# Altium project MotherBoard_9bit_SARADC.PrjPcb
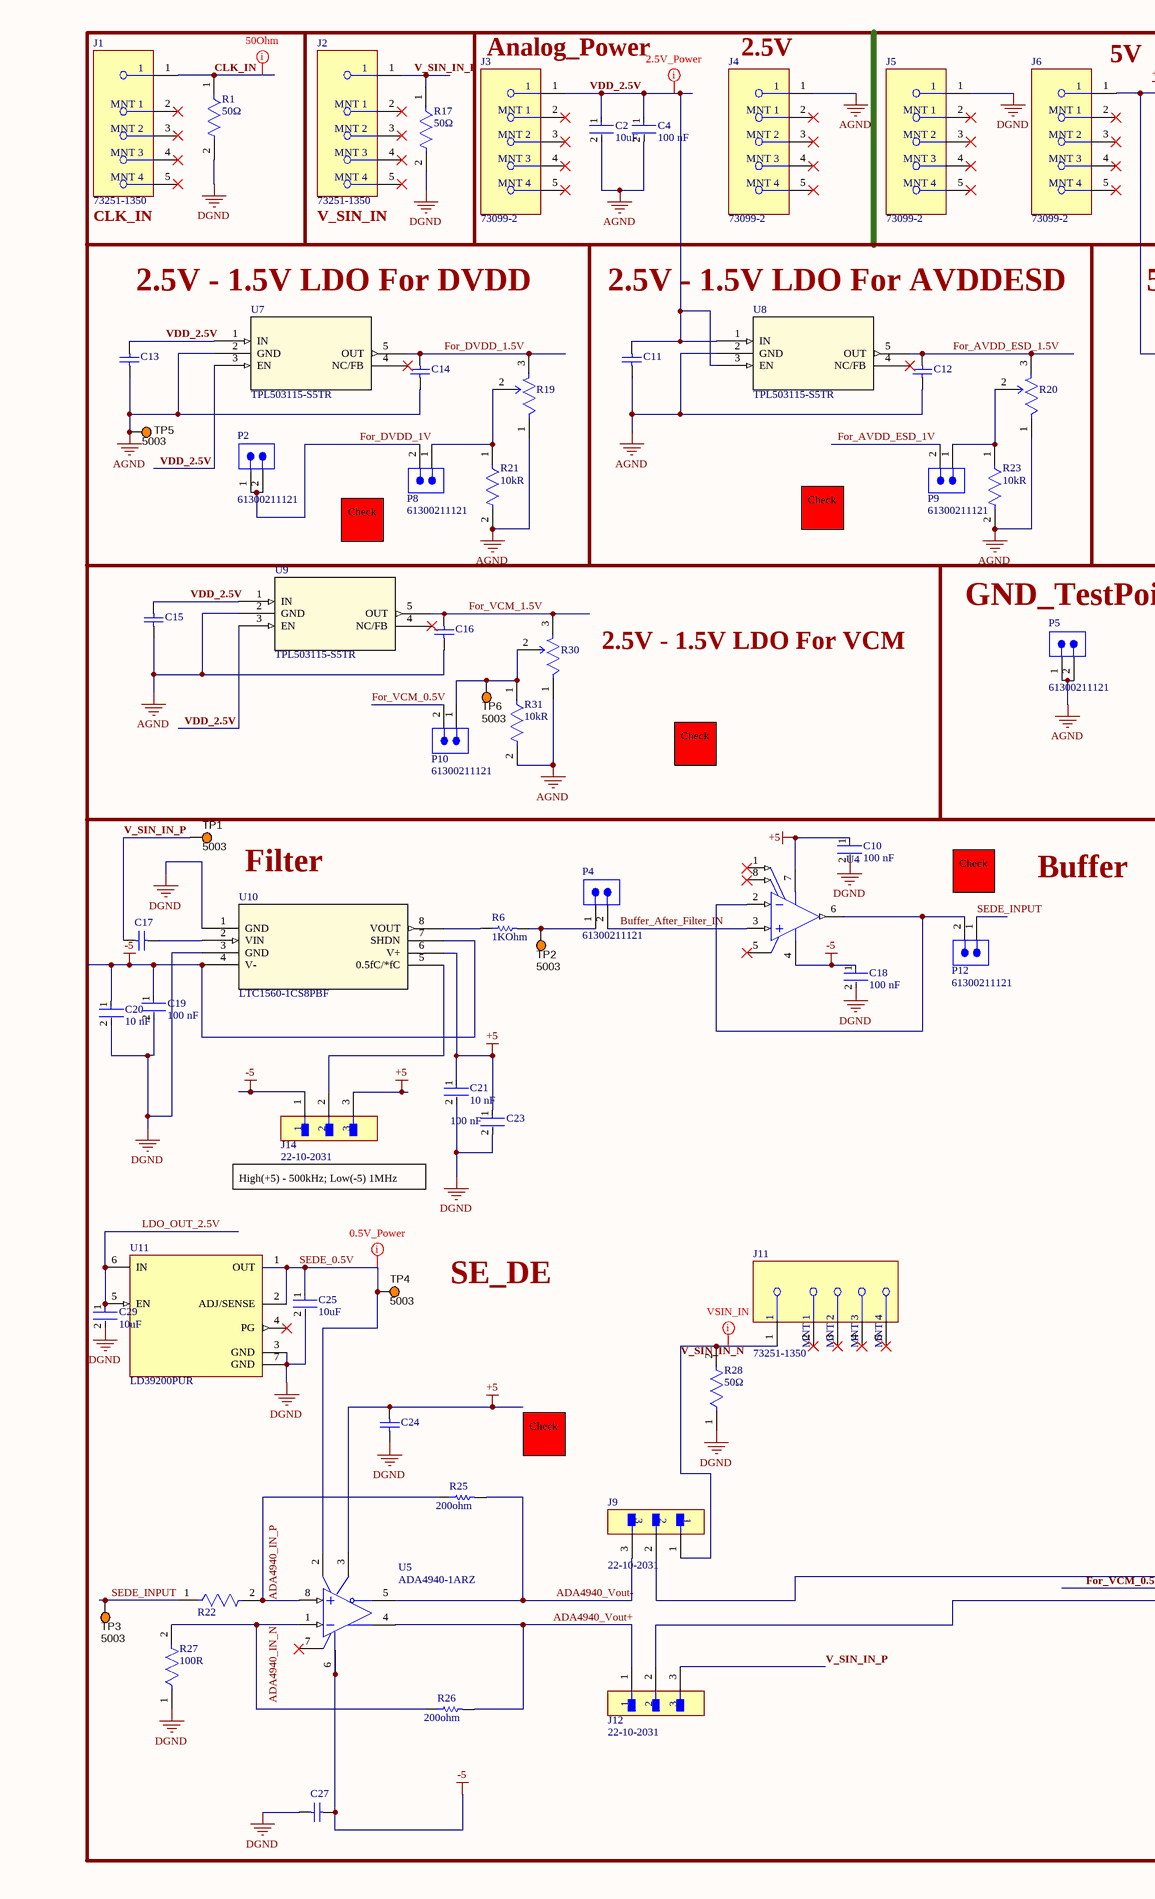
[diagram p0: MotherBoard.SchDoc, left]
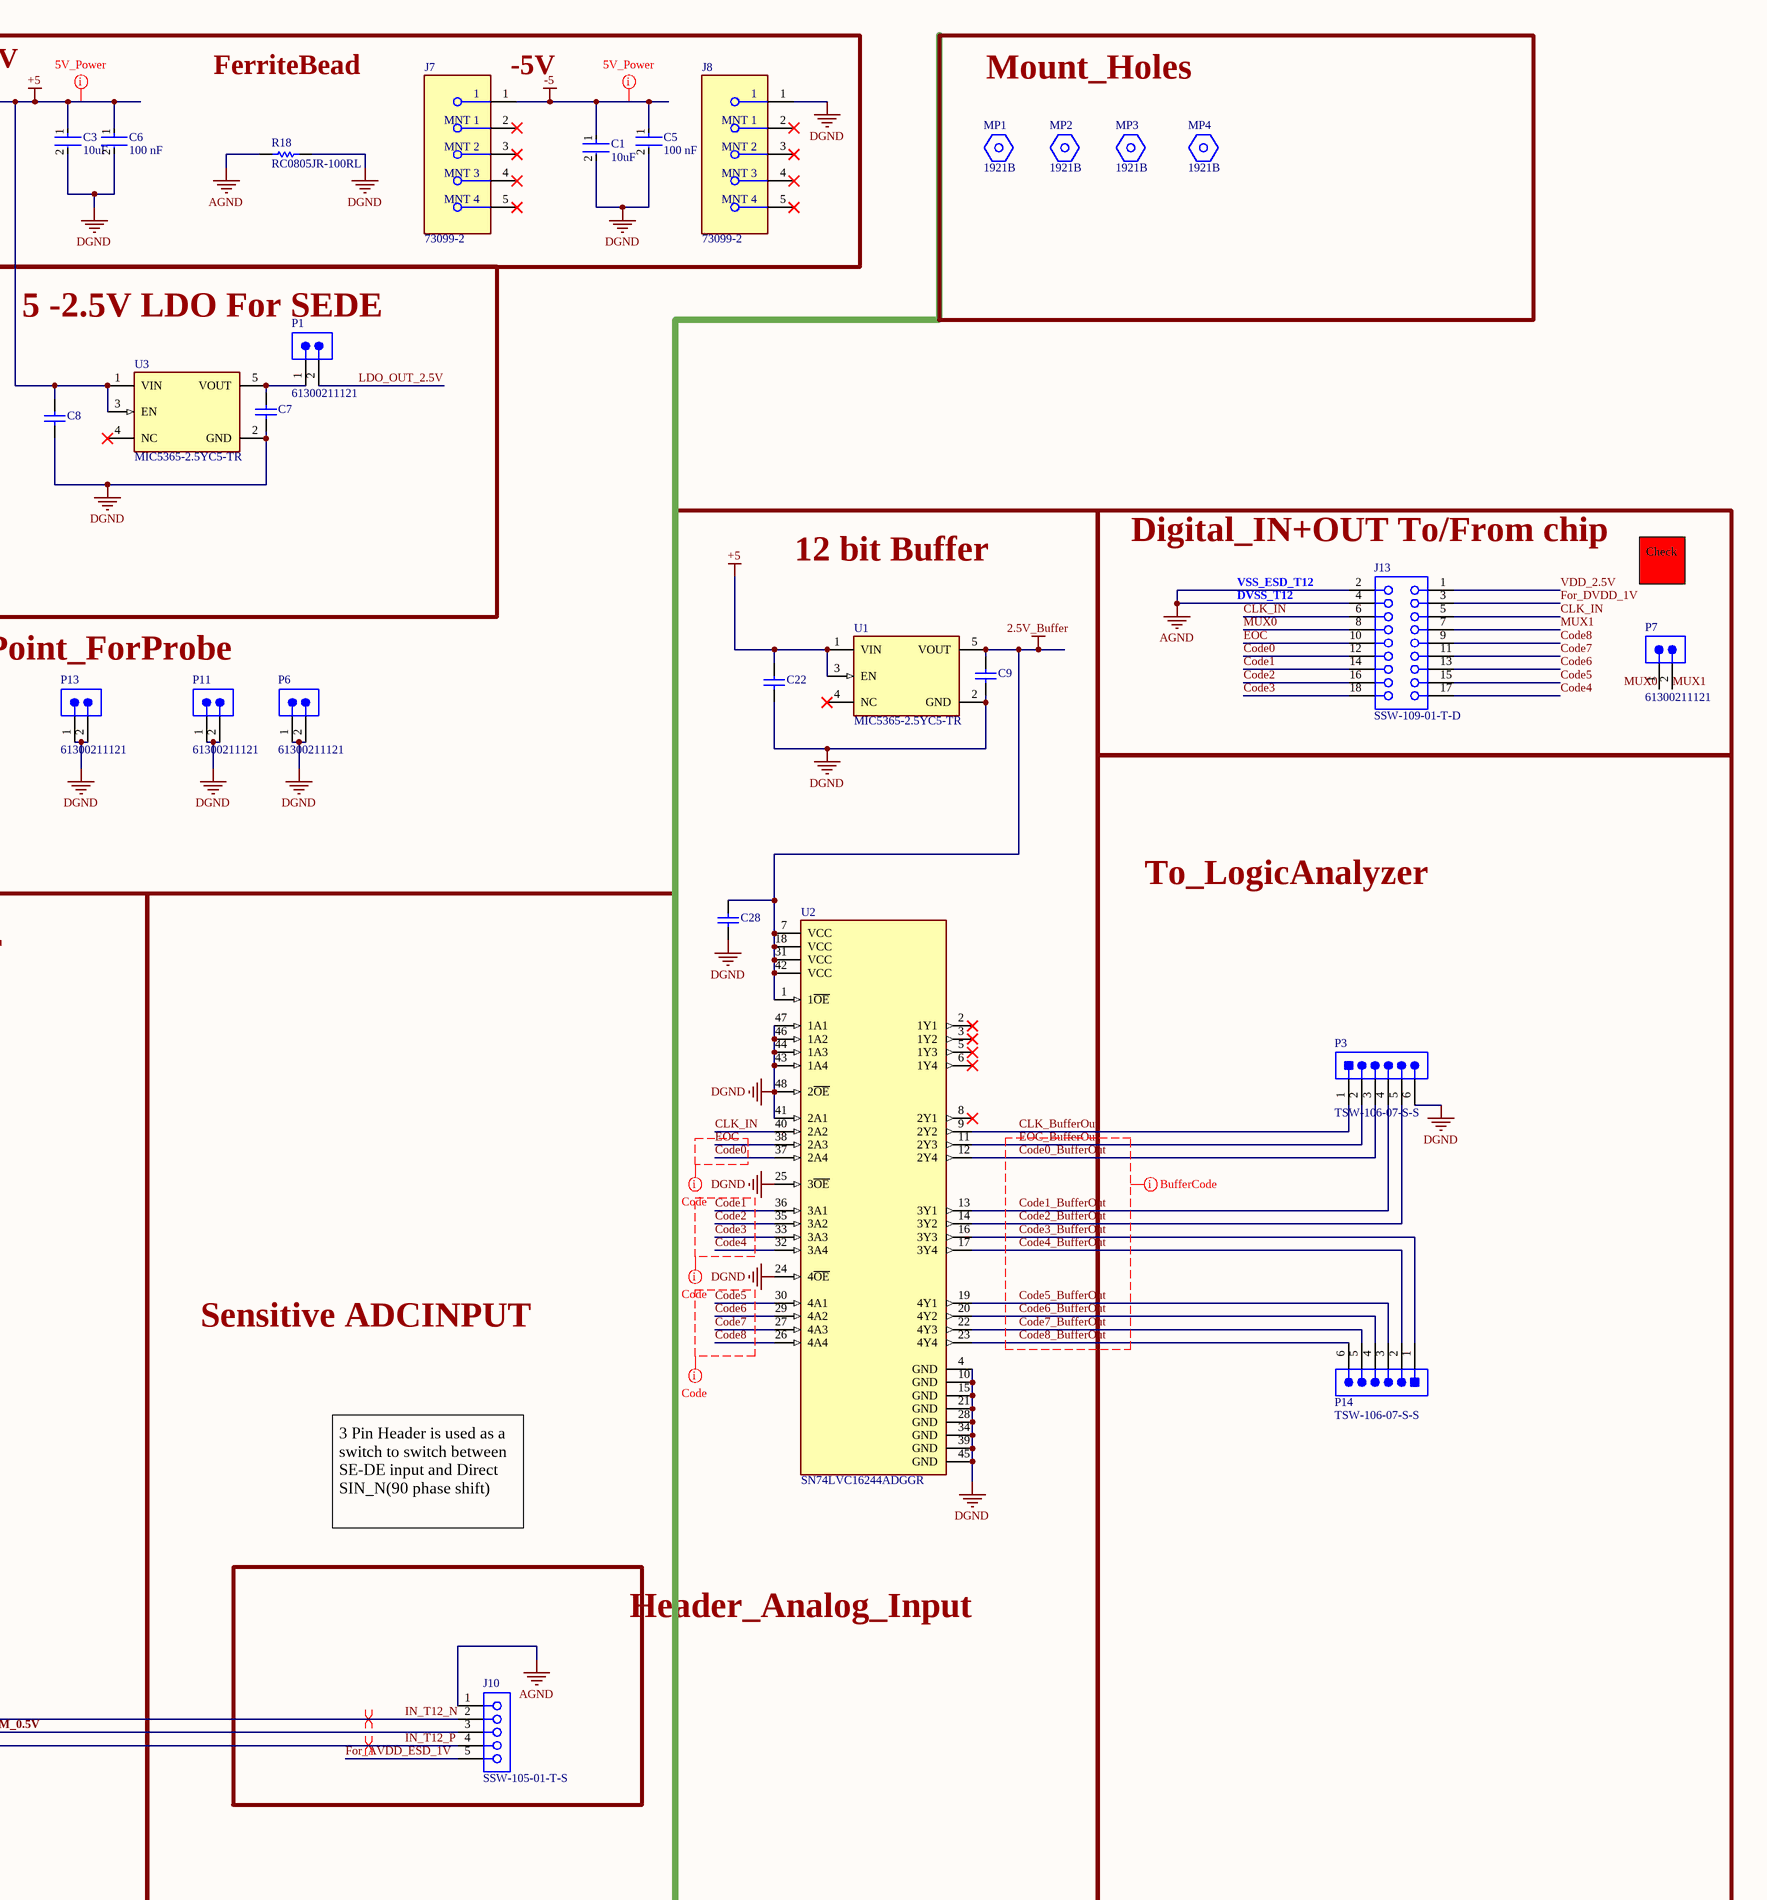
[diagram p1: MotherBoard.SchDoc, right]
1 sheet, 91 parts. Net scope: global (net labels, ports and power ports of the same name join across sheets).
Board file: MotherBoard_Layout.PcbDoc

## Sheet MotherBoard.SchDoc
size A2; SheetNumber: 1; SheetTotal: 1

### Parts
C1  Capacitance: 10uF  [FP-0805-L_2_01_0_2-W_1_25-MFG]  (hidden comment: 0805ZD106MAT2A)
C2  Capacitance: 10uF  [FP-0805-L_2_01_0_2-W_1_25-MFG]  (hidden comment: 0805ZD106MAT2A)
C3  Capacitance: 10uF  [FP-0805-L_2_01_0_2-W_1_25-MFG]  (hidden comment: 0805ZD106MAT2A)
C4  Capacitance: 100 nF  [FP-CC0805-0_85-MFG]  (hidden comment: CC0805KRX7R8BB104)
C5  Capacitance: 100 nF  [FP-CC0805-0_85-MFG]  (hidden comment: CC0805KRX7R8BB104)
C6  Capacitance: 100 nF  [FP-CC0805-0_85-MFG]  (hidden comment: CC0805KRX7R8BB104)
C7  0805ZC105KAZ2A  [CAPC2013X140X50LL20T25]  (value not drawn)
C8  0805ZC105KAZ2A  [CAPC2013X140X50LL20T25]  (value not drawn)
C9  0805ZC105KAZ2A  [CAPC2013X140X50LL20T25]  (value not drawn)
C10  Capacitance: 100 nF  [FP-CC0805-0_85-MFG]  (hidden comment: CC0805KRX7R8BB104)
C11  0805ZC105KAZ2A  [CAPC2013X140X50LL20T25]  (value not drawn)
C12  0805ZC105KAZ2A  [CAPC2013X140X50LL20T25]  (value not drawn)
C13  0805ZC105KAZ2A  [CAPC2013X140X50LL20T25]  (value not drawn)
C14  0805ZC105KAZ2A  [CAPC2013X140X50LL20T25]  (value not drawn)
C15  0805ZC105KAZ2A  [CAPC2013X140X50LL20T25]  (value not drawn)
C16  0805ZC105KAZ2A  [CAPC2013X140X50LL20T25]  (value not drawn)
C17  VJ0805D561KXBAJ  [CAPC2013X145X48ML20T23]  (value not drawn)
C18  Capacitance: 100 nF  [FP-CC0805-0_85-MFG]  (hidden comment: CC0805KRX7R8BB104)
C19  Capacitance: 100 nF  [FP-CC0805-0_85-MFG]  (hidden comment: CC0805KRX7R8BB104)
C20  Capacitance: 10 nF  [FP-CC0805-0_85-MFG]  (hidden comment: CC0805KRX7R9BB103)
C21  Capacitance: 10 nF  [FP-CC0805-0_85-MFG]  (hidden comment: CC0805KRX7R9BB103)
C22  0805ZC105KAZ2A  [CAPC2013X140X50LL20T25]  (value not drawn)
C23  Capacitance: 100 nF  [FP-CC0805-0_85-MFG]  (hidden comment: CC0805KRX7R8BB104)
C24  0805ZC105KAZ2A  [CAPC2013X140X50LL20T25]  (value not drawn)
C25  Capacitance: 10uF  [FP-0805-L_2_01_0_2-W_1_25-MFG]  (hidden comment: 0805ZD106MAT2A)
C27  0805ZC105KAZ2A  [CAPC2013X140X50LL20T25]  (value not drawn)
C28  0805ZC105KAZ2A  [CAPC2013X140X50LL20T25]  (value not drawn)
C29  Capacitance: 10uF  [FP-0805-L_2_01_0_2-W_1_25-MFG]  (hidden comment: 0805ZD106MAT2A)
J1  73251-1350  [FP-73251-1350-MFG]
J2  73251-1350  [FP-73251-1350-MFG]
J3  73099-2  [FP-73099-2-MFG]
J4  73099-2  [FP-73099-2-MFG]
J5  73099-2  [FP-73099-2-MFG]
J6  73099-2  [FP-73099-2-MFG]
J7  73099-2  [FP-73099-2-MFG]
J8  73099-2  [FP-73099-2-MFG]
J9  22-10-2031  [FP-22-10-2031-MFG]
J10  SSW-105-01-T-S  [SMTC-SSW-105-01-X-S]
J11  73251-1350  [FP-73251-1350-MFG]
J12  22-10-2031  [FP-22-10-2031-MFG]
J13  SSW-109-01-T-D  [SMTC-SSW-109-01-X-D]
J14  22-10-2031  [FP-22-10-2031-MFG]
MP1  1921B  [FP-1921B-MFG]
MP2  1921B  [FP-1921B-MFG]
MP3  1921B  [FP-1921B-MFG]
MP4  1921B  [FP-1921B-MFG]
P1  61300211121  [61300211121]
P2  61300211121  [61300211121]
P3  TSW-106-07-S-S  [SMTC-TSW-106-07-S-S_V]
P4  61300211121  [61300211121]
P5  61300211121  [61300211121]
P6  61300211121  [61300211121]
P7  61300211121  [61300211121]
P8  61300211121  [61300211121]
P9  61300211121  [61300211121]
P10  61300211121  [61300211121]
P11  61300211121  [61300211121]
P12  61300211121  [61300211121]
P13  61300211121  [61300211121]
P14  TSW-106-07-S-S  [SMTC-TSW-106-07-S-S_V]
R1  Resistance: 50Ω  [FP-D12-CRCW0805-MFG]  (hidden comment: CRCW080550R0FKTA)
R6  Resistance: 1KOhm  [RESC2013X60X35ML10T20]  (hidden comment: RC0805FR-071KL)
R17  Resistance: 50Ω  [FP-D12-CRCW0805-MFG]  (hidden comment: CRCW080550R0FKTA)
R18  RC0805JR-100RL  [RESC2013X60X35LL10T20]
R19  3296W-1-253LF  [FP-3296W-MFG]  (value not drawn)
R20  3296W-1-253LF  [FP-3296W-MFG]  (value not drawn)
R21  Resistance: 10kR  [FP-CRCW0805-e3-IPC_A]  (hidden comment: CRCW080510K0FKEA)
R22  CRCW0805100RFKEAHP  [FP-CRCW0805-HPe3-IPC_A]  (value not drawn)
R23  Resistance: 10kR  [FP-CRCW0805-e3-IPC_A]  (hidden comment: CRCW080510K0FKEA)
R25  value 200ohm  [RESC2013X70X40ML20T20]  (hidden comment: ERJ-6ENF2000V)
R26  value 200ohm  [RESC2013X70X40ML20T20]  (hidden comment: ERJ-6ENF2000V)
R27  Resistance: 100R  [FP-CRCW0805-HPe3-IPC_A]  (hidden comment: CRCW0805100RFKEAHP)
R28  Resistance: 50Ω  [FP-D12-CRCW0805-MFG]  (hidden comment: CRCW080550R0FKTA)
R30  3296W-1-253LF  [FP-3296W-MFG]  (value not drawn)
R31  Resistance: 10kR  [FP-CRCW0805-e3-IPC_A]  (hidden comment: CRCW080510K0FKEA)
TP1  5003  [KSTN-5003]
TP2  5003  [KSTN-5003]
TP3  5003  [KSTN-5003]
TP4  5003  [KSTN-5003]
TP5  5003  [KSTN-5003]
TP6  5003  [KSTN-5003]
U1  MIC5365-2.5YC5-TR  [FP-SC70-5LD-PL-1-MFG]
U2  SN74LVC16244ADGGR  [FP-DGG0048A-IPC_B]
U3  MIC5365-2.5YC5-TR  [FP-SC70-5LD-PL-1-MFG]
U4  LT1360CS8#PBF  [LT-S8-8_L]  (value not drawn)
U5  ADA4940-1ARZ  [ADI-R-8_L]
U7  TPL503115-S5TR  [SOT23-5-A_TPK]
U8  TPL503115-S5TR  [SOT23-5-A_TPK]
U9  TPL503115-S5TR  [SOT23-5-A_TPK]
U10  LTC1560-1CS8PBF  [SO-8_S_LIT-M]
U11  LD39200PUR  [FP-DFN6-7946637-IPC_A]

### Blocks framed on the sheet
CLK_IN: J1 R1
V_SIN_IN: J2 R17
Mount_Holes: MP1-MP4
2.5V - 1.5V LDO For DVDD: C13 C14 P2 P8 R19 R21 TP5 U7
2.5V - 1.5V LDO For AVDDESD: C11 C12 P9 R20 R23 U8
5 -2.5V LDO For SEDE: C7 C8 P1 U3
12 bit Buffer: C9 C22 C28 U1 U2
Digital_IN+OUT To/From chip: J13 P7
2.5V - 1.5V LDO For VCM: C15 C16 P10 R30 R31 TP6 U9
To_LogicAnalyzer: P3 P14
Header_Analog_Input: J10

### Nets
2.5V_Buffer: C9.2 C28.2 U1.5(VOUT) U2.1(1~{OE}) U2.7(VCC) U2.18(VCC) U2.31(VCC) U2.42(VCC)
+5: C3.1 C6.1 C8.2 C10.1 C21.1 C22.2 C23.1 C24.2 J6.1 J14.3 U1.1(VIN) U1.3(EN) U3.1(VIN) U3.3(EN) U4.7(V+) U5.3(VS+) U10.6(V+)
-5: C1.1 C5.1 C18.1 C19.1 C20.1 C27.2 J7.1 J14.1 U4.4(V-) U5.6(VS-) U10.4(V-) U10.7(SHDN)
AGND: C2.2 C4.2 C11.1 C12.1 C13.1 C14.1 C15.1 C16.1 J4.1 J10.1 J13.2 J13.4 P5.1 P5.2 R18.1 R19.1(CCW) R20.1(CCW) R21.2 R23.2 R30.1(CCW) R31.2 TP5.1 U7.2(GND) U8.2(GND) U9.2(GND)
DGND: C1.2 C3.2 C5.2 C6.2 C7.1 C8.1 C9.1 C10.2 C18.2 C19.2 C20.2 C21.2 C22.1 C23.2 C24.1 C25.2 C27.1 C28.1 C29.2 J5.1 J8.1 P3.6 P6.1 P6.2 P11.1 P11.2 P13.1 P13.2 R1.2 R17.2 R18.2 R27.1 R28.1 U1.2(GND) U2.4(GND) U2.10(GND) U2.15(GND) U2.21(GND) U2.24(4~{OE}) U2.25(3~{OE}) U2.28(GND) U2.34(GND) U2.39(GND) U2.41(2A1) U2.43(1A4) U2.44(1A3) U2.45(GND) U2.46(1A2) U2.47(1A1) U2.48(2~{OE}) U3.2(GND) U10.1(GND) U10.3(GND) U11.3(GND) U11.7(GND)
ADA4940_IN_N: R26.1 R27.2 U5.1(IN-)
ADA4940_IN_P: R22.2 R25.1 U5.8(IN+)
ADA4940_Vout+: J12.1 R26.2 U5.4(OUT+)
ADA4940_Vout-: J9.3 R25.2 U5.5(OUT-)
Buffer_After_Filter_IN: P4.2 U4.3(+IN)
CLK_BufferOut: P3.1 U2.9(2Y2)
CLK_IN: J1.1 J13.5 J13.6 R1.1 U2.40(2A2)
Code0: J13.12 U2.37(2A4)
Code0_BufferOut: P3.3 U2.12(2Y4)
Code1: J13.14 U2.36(3A1)
Code1_BufferOut: P3.4 U2.13(3Y1)
Code2: J13.16 U2.35(3A2)
Code2_BufferOut: P3.5 U2.14(3Y2)
Code3: J13.18 U2.33(3A3)
Code3_BufferOut: P14.1 U2.16(3Y3)
Code4: J13.17 U2.32(3A4)
Code4_BufferOut: P14.2 U2.17(3Y4)
Code5: J13.15 U2.30(4A1)
Code5_BufferOut: P14.3 U2.19(4Y1)
Code6: J13.13 U2.29(4A2)
Code6_BufferOut: P14.4 U2.20(4Y2)
Code7: J13.11 U2.27(4A3)
Code7_BufferOut: P14.5 U2.22(4Y3)
Code8: J13.9 U2.26(4A4)
Code8_BufferOut: P14.6 U2.23(4Y4)
EOC: J13.10 U2.38(2A3)
EOC_BufferOut: P3.2 U2.11(2Y3)
For_AVDD_ESD_1.5V: C12.2 R20.3(CW) U8.5(OUT)
For_AVDD_ESD_1V: J10.5 P9.2
For_DVDD_1.5V: C14.2 R19.3(CW) U7.5(OUT)
For_DVDD_1V: J13.3 P2.1 P2.2 P8.2
For_VCM_0.5V: J10.3 P10.2
For_VCM_1.5V: C16.2 R30.3(CW) U9.5(OUT)
IN_T12_N: J9.2 J10.2
IN_T12_P: J10.4 J12.2
LDO_OUT_2.5V: C29.1 P1.2 U11.5(EN) U11.6(IN)
MUX0: J13.8 P7.1
MUX1: J13.7 P7.2
SEDE_0.5V: C25.1 TP4.1 U5.2(VOCM) U11.1(OUT) U11.2(ADJ/SENSE)
SEDE_INPUT: P12.1 R22.1 TP3.1
V_SIN_IN_N: J9.1 J11.1 R28.2
V_SIN_IN_P: C17.1 J2.1 J12.3 R17.1 TP1.1
VDD_2.5V: C2.1 C4.1 C11.2 C13.2 C15.2 J3.1 J13.1 U7.1(IN) U7.3(EN) U8.1(IN) U8.3(EN) U9.1(IN) U9.3(EN)
NetC7_2: C7.2 P1.1 U3.5(VOUT)
NetC17_2: C17.2 U10.2(VIN)
NetJ14_2: J14.2 U10.5(0.5fC/*fC)
NetP4_1: P4.1 R6.2 TP2.1
NetP8_1: P8.1 R19.2(WIPER) R21.1
NetP9_1: P9.1 R20.2(WIPER) R23.1
NetP10_1: P10.1 R30.2(WIPER) R31.1 TP6.1
NetP12_2: P12.2 U4.2(-IN) U4.6(VOUT)
NetR6_1: R6.1 U10.8(VOUT)

Not connected (* = marked no-connect by the designer): J1 2(MNT_1)* 3(MNT_2)* 4(MNT_3)* 5(MNT_4)*; J2 2(MNT_1)* 3(MNT_2)* 4(MNT_3)* 5(MNT_4)*; J3 2(MNT_1)* 3(MNT_2)* 4(MNT_3)* 5(MNT_4)*; J4 2(MNT_1)* 3(MNT_2)* 4(MNT_3)* 5(MNT_4)*; J5 2(MNT_1)* 3(MNT_2)* 4(MNT_3)* 5(MNT_4)*; J6 2(MNT_1)* 3(MNT_2)* 4(MNT_3)* 5(MNT_4)*; J7 2(MNT_1)* 3(MNT_2)* 4(MNT_3)* 5(MNT_4)*; J8 2(MNT_1)* 3(MNT_2)* 4(MNT_3)* 5(MNT_4)*; J11 2(MNT_1)* 3(MNT_2)* 4(MNT_3)* 5(MNT_4)*; U1 4(NC)*; U2 2(1Y1)* 3(1Y2)* 5(1Y3)* 6(1Y4)* 8(2Y1)*; U3 4(NC)*; U4 1(NULL)* 5(NC)* 8(NULL)*; U5 7(~{DISABLE})*; U7 4(NC/FB)*; U8 4(NC/FB)*; U9 4(NC/FB)*; U11 4(PG)*

### Layout directives
differential pair: IN_T12_N, IN_T12_P
rule Width Constraint [Pref Width = 40mil    Min Width = 20mil    Max Width = 100mil]: -5
rule Width Constraint [Pref Width = 20mil    Min Width = 20mil    Max Width = 100mil]: +5, SEDE_0.5V, VDD_2.5V
net class CLK: CLK_IN
net class INPUT_Signal: V_SIN_IN_N
net class Buffer_OUT: Code0_BufferOut, Code1_BufferOut, Code2_BufferOut, Code3_BufferOut, Code4_BufferOut, Code5_BufferOut, Code6_BufferOut, Code7_BufferOut, Code8_BufferOut, EOC_BufferOut
net class Code: Code0, Code1, Code2, Code3, Code4, Code5, Code6, Code7, Code8, EOC

### Notes on the sheet
- (near J3) Analog_Power
- (near J4) 2.5V
- (near J6) 5V
- FerriteBead
- (near J7) -5V
- Check
- DVSS_T12
- VSS_ESD_T12
- GND_TestPoint_ForProbe
- Filter
- Buffer
- High(+5) - 500kHz; Low(-5) 1MHz
- Sensitive ADCINPUT
- SE_DE
- 3 Pin Header is used as a switch to switch between SE-DE input and Direct SIN_N(90 phase shift)

### Library data of the parts
C1-C3 C25 C29 = CMP-2007-04682-2: General Purpose Ceramic Capacitor, 0805, 10uF, 20%, X5R, 15%, 10V; Dissipation Factor: 12.5%; Insulation Resistance: 10GR; Contact Plating: Tin; Packaging: Tape and Reel; Length: 2.01mm; Dielectric: X5R; RoHS Compliant: Yes; Series: -; Case Code (Metric): 2012; Tolerance: 20%; Min Operating Temperature: -55°C; REACH SVHC: No SVHC; Termination: SMD/SMT; Width: 0.049inch; Mount: Surface Mount; Construction: Flat; Lead Free: Lead Free; Depth: 1.25mm; Height: 1.3mm; Voltage: 10V; Case Code (Imperial): 0805; Package Quantity: 3000; Number of Pins: 2; Voltage Rating (DC): 10V; Radiation Hardening: No; Case/Package: 0805; Max Operating Temperature: 85°C; Voltage Rating: 10V; Thickness: 0.055inch; Dielectric Material: Ceramic
C4-C6 C10 C18 C19 C23 = CMP-1036-04410-2: CAP CER 0.1UF 25V X7R 0805; Manufacturer: Yageo; Tolerance: 0.1; Material: Ceramic; Value: 100 nF; ComponentLink2URL: http://www.yageo.com/documents/recent/UPY-GPHC_Y5V_6.3V-to-50V_8.pdf; Category: Cap; Mouser Description: Multilayer Ceramic Capacitors MLCC - SMD/SMT 100nF 25V X7R 10%; Manufacturer Part Number: CC0805KRX7R8BB104; Device Class L1: Passive Components; Footprint Url: http://www.yageo.com/exep/pages/download/literatures/UPY-C_GEN_24.pdf; Height: 0.95mm; Digikey Description: CAP CER 0.1UF 25V X7R 0805; Lead Free: Yes; Temperature Range High: +85°C; Temperature: -30°C to +85°C; Ipc Land Pattern Name: CAPC200125X85; Automotive: No; Octopart: https://octopart.com/cc0805krx7r8bb104-yageo-39467766; Device Class L2: Capacitors; Temperature Characteristic: X7R; Voltage Rating: 25 V; ComponentLink2Description: Datasheet; Temperature Range Low: -30°C; Device Class L3: Ceramic Capacitors; RoHS: TRUE; Package: CC0805-0.85
C7-C9 C11-C16 C22 C24 C27 C28 = CMP-2007-04674-1: Manufacturer: AVX Interconnect / Elco; Part Number: 0805ZC105KAZ2A
C17 = CMP-2007-03149-1: Manufacturer: Vitramon; Part Number: VJ0805D561KXBAJ
C20 C21 = CMP-1036-03842-3: CAP CER 10000PF 50V X7R 0805; Manufacturer: Yageo; Material: Ceramic; Value: 10 nF; Tolerance: 0.1; Footprint Url: http://www.yageo.com/exep/pages/download/literatures/UPY-C_GEN_24.pdf; Temperature Characteristic: X7R; ComponentLink2Description: Datasheet; Lead Free: Yes; Height: 0.95mm; Temperature Range High: +85°C; Automotive: No; Octopart: https://octopart.com/cc0805krx7r9bb103-yageo-192989; Device Class L1: Passive Components; Mouser Description: Multilayer Ceramic Capacitors MLCC - SMD/SMT 10nF 50V X7R 10%; Temperature: -30°C to +85°C; Device Class L2: Capacitors; Ipc Land Pattern Name: CAPC200125X85; Device Class L3: Ceramic Capacitors; Temperature Range Low: -30°C; RoHS: TRUE; Manufacturer Part Number: CC0805KRX7R9BB103; Voltage Rating: 50 V; Package: CC0805-0.85; Category: Cap; ComponentLink2URL: http://www.yageo.com/documents/recent/UPY-GPHC_Y5V_6.3V-to-50V_8.pdf; Digikey Description: CAP CER 10000PF 50V X7R 0805
J1 J2 J11 = CMP-04764-000006-1: CONN SMA JACK STR 50 OHM SMD; Manufacturer: Molex; Is Female: yes; Standoff Height: 0.41mm; Impedance: 50Ω; Number Of Contacts: 1; Conn Orientation: Straight; Voltage Rating: 500V; Shielding: true; Frequency: 18GHz; Package: 73251-1350; Device Class L1: Connectors; Category: Conn; Manufacturer Part Number: 73251-1350; ComponentLink2URL: https://www.molex.com/pdm_docs/sd/732511350_sd.pdf; Automotive: No; Height: 9.655mm; Octopart: https://octopart.com/73251-1350-molex-5414390; Footprint Url: https://forum.upverter.com/uploads/default/original/3X/d/a/daeafa2ce4908d4fc4e49f0b17d7d2c986fce444.pdf; Temperature Range High: +165°C; Device Class L3: unset; Mouser Description: RF Connectors / Coaxial Connectors SMA ST PCB-JCK STD SMT; Lead Free: Yes; Temperature: -65°C to +165°C; RoHS: TRUE; ComponentLink2Description: Datasheet; Device Class L2: RF / Coaxial Connectors; Digikey Description: CONN SMA JACK STR 50 OHM SMD; Contact Material: Gold; Temperature Range Low: -65°C
J3-J8 = CMP-73906-000005-1: R/A 4MM MOUNTG SAFE JACK/PCB RED
J9 J12 J14 = CMP-04776-000653-1: CONN HEADER VERT 3POS 2.54MM; Insulation Resistance: 50GR; Glow Wire Compliant: Non-compliant; Number of Contacts: 3; Max Current Rating: 4A; Voltage Rating (DC): 250V; Gender: Male; Contact Resistance: 10mR; Approvals: UL; Color: White; Radiation Hardening: No; Pitch: 2.54mm; Packaging: Bulk; Orientation: Straight; Housing Material: Nylon; Depth: 2.34mm; Flammability Rating: UL94 V-0; Number of Circuits: 3; Min Operating Temperature: 0°C; Lead Free: Lead Free; Contact Plating: Gold; Halogen Free: Low Halogen; Max Voltage Rating (AC): 250V; Length: 7.37mm; Height: 10.79mm; Current Rating: 4A; Series: KK® 4030; Contact Material: Brass; Number of Rows: 1; Housing Color: White; Voltage Rating: 250V; Package Quantity: 2000; Number of Positions: 3; Contact Type: Male Pin; Mount: Through Hole; Max Operating Temperature: 75°C; Termination: Solder; Contact Mating Length: 0.295inch
J10 = CMP-1023-00345-1: SQ Post Socket, Through-hole, Vertical, -55 to 105 degC, 2.54mm Pitch, 5-Pin, Female, RoHS; Manufacturer: Samtec; Pitch: 2.54 mm; Orientation: Vertical; ComponentLink1Description: Manufacturer URL; ComponentLink1URL: http://www.samtec.com; RoHS: True; PackageDescription: Assembly, Socket Strip .016 X .031 Tail; PackageReference: SSW-105-01-X-S; ComponentLink3URL: http://www.samtec.com/documents/webfiles/cpdf/SSW-1XX-XX-XXX-X-XX-XXX-XX-MKT.pdf; PartNumber: SSW-105-01-T-S; Temperature Range: -55 to 105 degC; Mounting Technology: Through-hole; PackageVersion: CA, 6/1987; ComponentLink2URL: http://www.samtec.com/documents/webfiles/pdf/SSW_TH.PDF; DatasheetVersion: F-214; ComponentLink2Description: Datasheet; ComponentLink3Description: Package Specification
J13 = CMP-1023-00387-1: SQ Post Socket, Through-hole, Vertical, -55 to 105 degC, 2.54mm Pitch, 18-Pin, Female, RoHS; Manufacturer: Samtec; Mounting Technology: Through-hole; Orientation: Vertical; Pitch: 2.54 mm; DatasheetVersion: F-214; ComponentLink3Description: Package Specification; ComponentLink1Description: Manufacturer URL; PartNumber: SSW-109-01-T-D; RoHS: True; PackageVersion: CA, 6/1987; ComponentLink2URL: http://www.samtec.com/documents/webfiles/pdf/SSW_TH.PDF; ComponentLink2Description: Datasheet; ComponentLink3URL: http://www.samtec.com/documents/webfiles/cpdf/SSW-1XX-XX-XXX-X-XX-XXX-XX-MKT.pdf; PackageDescription: Assembly, Socket Strip .016 X .031 Tail; Temperature Range: -55 to 105 degC; PackageReference: SSW-109-01-X-D; ComponentLink1URL: http://www.samtec.com
MP1-MP4 = CMP-00214-00374361-1: 1921B Standoff, 1/4 Hex, Female, Threaded 4-40, Length .500, Stainless Steel; NexarPartId: 374361; Outside Diameter: 6.35mm; Gender: Female, Female; Length: 12.7mm; Threaded/Unthreaded: Threaded; Width: 6.35mm; Color: Natural; Shape: Hex; RoHS: Compliant; Lead Free: Lead Free; Material: Stainless Steel; Height: 12.827mm; Diameter: 6.35mm
P1 P2 P4-P13 = CMP-1712-00002-6: NexarPartId: 20081794; Number of Contacts: 2; Pitch: 2.54mm; Connector Type: Male Pin; Voltage Rating: 250V; Current Rating: 3A; Gender: Male; Contact Resistance: 20mΩ; Height: 8.94mm; Lead Free: Lead Free; Number of Pins: 2; Termination: Through Hole; RoHS: Compliant; Lead Pitch: 2.54mm; REACH SVHC: No SVHC; Housing Material: PBT; Contact Mating Length: 5.9944mm; Min Operating Temperature: -40°C; Orientation: Vertical; Contact Material: Copper; Contact Gender: Male; Max Operating Temperature: 125°C; Number of Rows: 1; Number of Positions: 2; Packaging: Bulk; Contact Plating: Gold; Mount: Through Hole; Color: Black; Operating Supply Voltage: 250V
P3 P14 = CMP-1681-00007-2: Male Header, Pitch 2.54 mm, 1 x 6 Position, Height 8.38 mm, Tail Length 2.54 mm, -55 to 125 degC, RoHS, Bulk; Manufacturer: Samtec; Rows: 1; Contact Finish: Gold; Lead Pitch: 0.1 inch; Package Quantity: 1; Mounting Technology: Through Hole; ComponentLink1Description: Manufacturer URL; Contact Plating: Gold; DatasheetVersion: 12/2015; ComponentLink3Description: Package Specification; PackageDescription: Male Header, Pitch 2.54 mm, 1 x 6 Position, Height 8.38 mm, Tail Length 2.54 mm; Height: 8.38 mm; ComponentLink2Description: Datasheet; RoHSCompliant: true; Colour: Black; Packaging: Bulk; Min Operating Temperature: -55 degC; ComponentLink2URL: http://suddendocs.samtec.com/catalog_english/tsw_th.pdf; Mount: Through Hole; PackageReference: TSW-102-07-S-S; Pins: 6; Max Operating Temperature: 125 degC; ComponentLink3URL: http://suddendocs.samtec.com/prints/tsw-xxx-xx-x-x-xx-xxx-footprint.pdf; Length: 15.24 mm; Contact Material: Bronze; ComponentLink1URL: http://www.samtec.com/
R1 R17 R28 = CMP-00030-21390498-1: CRCW080550R0FKTA Res Thick Film 0805 50 Ohm 1% 0.125W(1/8W) ±100ppm/C Pad SMD Automotive T/R; Temperature Coefficient: 100ppm/°C; Voltage Rating: 150V; Power Rating: 125mW; Length: 2mm; Case Code (Imperial): 0805; Height: 450µm; Contact Plating: Lead, Tin; Width: 1.25mm; Max Operating Temperature: 155°C; NexarPartId: 21390498; Case Code (Metric): 2012; Min Operating Temperature: -55°C; Tolerance: 1%; Case/Package: 0805; Lead Free: Contains Lead; RoHS: Non-Compliant; Composition: Thick Film; Weight: 5.499807mg
R6 = CMP-2100-03671-1: Chip Resistor, 1 KOhm, +/- 1%, 125 mW, -55 to 155 degC, 0805 (2012 Metric), RoHS, Tape and Reel; Manufacturer: Yageo; Temperature Coefficient: 100ppm/degreesC; Voltage Rating (DC): 150V; Max Power Dissipation: 125mW; Number of Pins: 2; Number of Terminations: 2; Datasheet URL: http://www.yageo.com/NewPortal/yageodocoutput?fileName=/pdf/R-Chip/PYu-RC_Group_51_RoHS_L_5.pdf; Length: 0.079inch; Package Description: 2-Pin Surface Mounted Device, Body 2 x 1.25 mm; Depth: 1.25mm; Height: 0.024inch; Military Standard: Not; Case/Package: 0805; Package Reference: 0805; RoHSCompliant: true; Lead Free: LeadFree; Packaging: TapeandReel; Package Quantity: 1; Datasheet Version: Rev. 5, 10/2016; Tolerance: 1%; Min Operating Temperature: -55degC; Voltage Rating: 150V; Composition: ThickFilm; Case Code (Imperial): 0805; Power Rating: 125mW; Width: 0.049inch; Case Code (Metric): 2012; Manufacturer URL: http://www.yageo.com/; Max Operating Temperature: 155degC; REACH SVHC: Unknown; Termination: SMD/SMT
R18 = CMP-2000-06963-1: Chip Resistor, 0 Ohm, +/- 5%, 125 mW, -55 to 155 degC, 0805 (2012 Metric), RoHS, Tape and Reel; Manufacturer: Yageo; Product Length (mm): 2mm; Tolerance (+ or -): NotRequired; Case Style: Molded; Product Height (mm): 0.5mm; Power Rating(s): NotRequiredW; Product Depth (mm): 1.25mm; Mounting Technology: SurfaceMount; Military Standard: NotRequired; Operating Temp Range: -55Cto155C; Temperature Coefficient: NotRequired; Package Description: 2-Pin Surface Mounted Device, Body 2 x 1.25 mm; Datasheet Version: Rev. 7, 05/2017; Failure Rate: NotRequired; Manufacturer URL: http://www.yageo.com/; Datasheet URL: http://www.yageo.com/documents/recent/PYu-RC_Group_51_RoHS_L_7.pdf; Packaging: TapeandReel; Package Reference: 0805; Package / Case: 0805; Termination Style: NotRequired; Type: ThickFilm; Construction: Rectangular
R19 R20 R30 = CMP-07234-000034-1: TRIMMER 25K OHM 0.5W PC PIN TOP; Temperature Coefficient: 100ppm/°C; Resistance Tolerance: 10%; Resistance: 25kR; Power Rating: 500mW; Number of Turns: 25; Voltage Rating (DC): 300V; Taper: Linear; Resistor Type: Cermet; REACH SVHC: No SVHC; Height: 0.395inch; Military Standard: Not; Color: Blue; Tolerance: 10%; Depth: 4.83mm; Package Quantity: 50; Termination: Pin; Radiation Hardening: No; Packaging: Rail/Tube; Lead Free: Lead Free; Length: 9.53mm; Series: 3296; Weight: 0.03oz; RoHS Compliant: Yes; Mount: Panel; Max Power Dissipation: 500mW; Width: 9.53mm; Technology: CERMET; Min Operating Temperature: -55°C; Max Operating Temperature: 125°C
R21 R23 R31 = CMP-2001-04908-2: RES Thick Film, 10kΩ, 1%, 0.125W, 100ppm/°C, 0805; Voltage Rating (DC): 150V; Power Rating: 125mW; Weight: 0.000194oz; Package Quantity: 5000; Military Standard: Not; Max Operating Temperature: 155°C; Temperature Coefficient: 100ppm/°C; Contact Plating: Tin; Width: 1.25mm; Height: 0.45mm; Radiation Hardening: No; Tolerance: 1%; Min Operating Temperature: -55°C; Voltage Rating: 150V; Length: 2mm; Depth: 1.25mm; Termination: SMD/SMT; Packaging: Tape and Reel; Case/Package: 0805; Case Code (Metric): 2012; Lead Free: Lead Free; Case Code (Imperial): 0805; Composition: Thick Film
R22 = CMP-02407-011702-1: RES Thick Film, 100Ω, 1%, 0.5W, 100ppm/°C, 0805; Power Rating: 330mW; Voltage Rating: 150V; Max Power Dissipation: 500mW; Resistance: 100R; Case/Package: 0805; Radiation Hardening: No; Number of Terminations: 2; Features: Automotive AEC-Q200; RoHS Compliant: Yes; Height: 0.5mm; Technology: THICK FILM; Contact Plating: Tin; Series: CRCW-HP; Max Operating Temperature: 155°C; Tolerance: 1%; Package Quantity: 5000; Construction: Rectangular; Width: 1.2mm; Lead Free: Lead Free; Resistor Type: Thick Film; Resistance Tolerance: 1%; Length: 2mm; Weight: 0.000194oz; Termination: SMD/SMT; Depth: 1.25mm; Packaging: Tape and Reel; Voltage Rating (DC): 150V; Case Code (Imperial): 0805; Military Standard: Not; Case Code (Metric): 2012; Mount: Surface Mount; Min Operating Temperature: -55°C; Temperature Coefficient: 100ppm/°C
R25 R26 = CMP-2001-00025-1: Manufacturer: Panasonic; Part Number: ERJ-6ENF2000V
R27 = CMP-02407-011702-1: RES Thick Film, 100Ω, 1%, 0.5W, 100ppm/°C, 0805; Power Rating: 330mW; Voltage Rating: 150V; Max Power Dissipation: 500mW; Case/Package: 0805; Radiation Hardening: No; Number of Terminations: 2; Features: Automotive AEC-Q200; RoHS Compliant: Yes; Height: 0.5mm; Technology: THICK FILM; Contact Plating: Tin; Series: CRCW-HP; Max Operating Temperature: 155°C; Tolerance: 1%; Package Quantity: 5000; Construction: Rectangular; Width: 1.2mm; Lead Free: Lead Free; Resistor Type: Thick Film; Resistance Tolerance: 1%; Length: 2mm; Weight: 0.000194oz; Termination: SMD/SMT; Depth: 1.25mm; Packaging: Tape and Reel; Voltage Rating (DC): 150V; Case Code (Imperial): 0805; Military Standard: Not; Case Code (Metric): 2012; Mount: Surface Mount; Min Operating Temperature: -55°C; Temperature Coefficient: 100ppm/°C
TP1-TP6 = CMP-1672-00009-1: Test Point, Orange, 1-Pin THD, RoHS; Peak Reverse Current: 600 uA; Forward Current: 3 A; Max Surge Current: 80 A; Forward Voltage: 1.08 V; Max Operating Temperature: 150 degC; PackageReference: 5003; Pins: 2; ComponentLink2URL: http://keyelco.com/userAssets/file/M65p56.pdf; PackageDescription: 1-Pin Through Hole Device, Dia 2.54 mm; Weight: 0.01 lb; Diameter: 5.3 mm; Mount: Through Hole; Package Quantity: 500; Packaging: Bulk; Min Operating Temperature: -65 degC; ComponentLink1Description: Manufacturer URL; Height: 0.25 inch; ComponentLink1URL: http://www.keyelco.com/; ComponentLink2Description: Datasheet; Width: 0.25 inch; REACH SVHC: No SVHC; RoHSCompliant: true; Radiation Hardening: No; Length: 9.5 mm; DatasheetVersion: Jun-15
U1 U3 = CMP-06324-000051-1: IC REG LINEAR 2.5V 150MA SC70-5; Output Voltage Accuracy: 2%; Max Input Voltage: 5.5V; Quiescent Current: 39uA; Output Type: Fixed; Number of Outputs: 1; Min Current Limit: 200mA; Polarity: Positive; Dropout Voltage: 180mV; Power Supply Rejection Ratio (PSRR): 80dB; REACH SVHC: No SVHC; Min Output Voltage: 2.5V; Lead Free: Lead Free; RoHS Compliant: Yes; Mount: Surface Mount; Min Operating Temperature: -40°C; Output Current: 150mA; Nominal Output Voltage: 2.5V; Case/Package: SC; Packaging: Tape and Reel; Number of Regulators: 1; Series: -; Radiation Hardening: No; Number of Pins: 5; Package Quantity: 1; Output Voltage: 2.5V; Max Operating Temperature: 125°C; Max Output Current: 150mA; Min Input Voltage: 2.5V
U2 = CMP-0440-00473-4: IC BUF NON-INVERT 3.6V 48TSSOP; Number of Channels: 16; Logic Function: Buffer; Low Level Output Current: 24mA; Polarity: Non-Inverting; Number of Bits per Element: 4; Quiescent Current: 20uA; Schmitt Trigger Input: No; Propagation Delay: 4.1ns; Number of Output Lines: 3; High Level Output Current: -24mA; Min Supply Voltage: 1.65V; Turn-On Delay Time: 10.3ns; Output Type: 3-STATE; Number of Pins: 48; Number of Outputs: 16; RoHS Compliant: Yes; Max Supply Voltage: 3.6V; Lead Free: Lead Free; REACH SVHC: No SVHC; Package Quantity: 2000; Case/Package: TSSOP; Termination: SMD/SMT; Series: 74LVC; Contact Plating: Gold; Number of Input Lines: 16; Max Operating Temperature: 125°C; Radiation Hardening: No; Number of Inputs: 16; Technology: CMOS; Number of Bits: 16; Min Operating Temperature: -40°C; Width: 6.2mm; Height: 1.05mm; Number of Elements: 4; Mount: Surface Mount; Packaging: Tape and Reel; Length: 12.6mm
U4 = CMP-0359-02753-2: Single Channel, High Speed Precision Operational Amplifier, 50 MHz Typical GBW, 800 V/us Typical SR, 3 to 36 V, 8-Pin SOIC (S8-8), Commerical, Pb-Free; Linear Technology Part Number: LT1360; Manufacturer: Linear Technology; SR (V/us) Typical: 800; Vos (mV) Typical: 0.3; Channels (#): 1; Vs Max (V): 36; Is (mA) Typical: 3.8; Vs Min (V): 3; GBW (MHz) Typical: 50; Mounting Technology: Surface Mount; ComponentLink1URL: http://www.linear.com/; PackageVersion: Rev G; RevisionNote: URLs updated; PartNumber: LT1360CS8#PBF; ComponentLink3URL: http://cds.linear.com/docs/en/packaging/05081610_G_SO8.pdf; ComponentLink3Description: Package Specification; PackageDescription: 8-Pin Plastic Small Outline, Body 4.9 x 3.9 mm, Pitch 1.27 mm; DatasheetVersion: Rev. A; ComponentLink2URL: http://cds.linear.com/docs/en/datasheet/1360fa.pdf; ComponentLink1Description: Manufacturer URL; RoHS: Pb-Free; Type: VFB; PackageReference: LT-S8-8; ComponentLink2Description: Datasheet
U5 = CMP-1331-00005-2: Ultralow Power, Low Distortion Fully Differential ADC Driver, 3 to 6 V, -40 to 125 degC, 8-Pin SOIC_N (R-8), RoHS, Tube
U7-U9 = TPL503115-S5TR: No Description Available; Mfr_Name: 3Peak; RefDes: RefDes; Type: Type
U10 = LTC1560-1CS8PBF: No Description Available; Mfr_Name: Analog Devices Inc; RefDes: RefDes; Type: Type
U11 = CMP-12153-000004-1: IC REG LINEAR POS ADJ 2A 6DFN; Manufacturer: STMicroelectronics; Nominal Supply Current: 100-1000uA; Accuracy Percentage: 1%; Number Of Outputs: 1; Max Supply Voltage: 6V; Standoff Height: 0mm; Output Type: AdjustableProgrammable; Max Junction Temp: +125°C; Dropout Voltage: 135mV; Min Supply Voltage: 1.25V; Temperature Range Low: -40°C; Package: DFN6-7946637; Output Current: 2A; ComponentLink2URL: https://www.st.com/resource/en/datasheet/ld39200.pdf; Device Class L2: Power Management ICs; Temperature: -40°C to +125°C; Manufacturer Part Number: LD39200PUR; Lead Free: Yes; ComponentLink2Description: Datasheet; RoHS: TRUE; Octopart: https://octopart.com/ld39200pur-stmicroelectronics-77085816; Height: 1mm; Digikey Description: IC REG LINEAR POS ADJ 2A 6DFN; Device Class L3: Voltage Regulators - Linear; Automotive: No; Category: IC; Temperature Range High: +125°C; Device Class L1: Integrated Circuits (ICs)